# Altium schematic sheet Top Level.SchDoc
size A
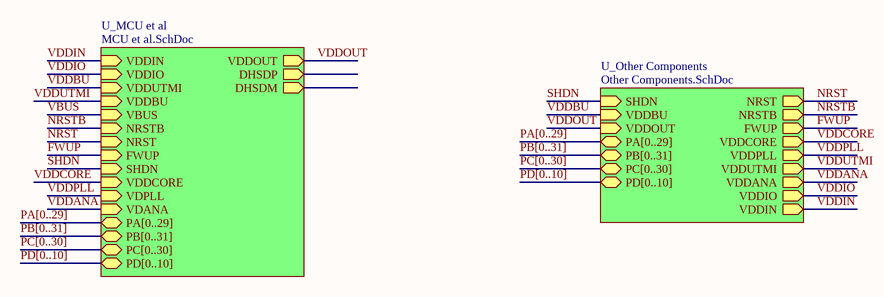
[diagram p0: Top Level.SchDoc]

## Sub-sheets
U_MCU et al = MCU et al.SchDoc: VDDOUT (out), VDDIN (in), VDDIO (in), VDDUTMI (in), VDDBU (in), DHSDP (out), DHSDM (out), VBUS (in), NRSTB (in), NRST (in), FWUP (in), SHDN (in), VDDCORE (in), VDPLL (in), VDANA (in), PA[0..29] (bidir), PB[0..31] (bidir), PC[0..30] (bidir), PD[0..10] (bidir)
U_Other Components = Other Components.SchDoc: SHDN (in), NRST (out), NRSTB (out), VDDBU (in), FWUP (out), VDDOUT (in), VDDCORE (out), VDDPLL (out), VDDUTMI (out), VDDANA (out), VDDIO (out), VDDIN (out), PA[0..29] (bidir), PB[0..31] (bidir), PC[0..30] (bidir), PD[0..10] (bidir)

## Nets
FWUP: sheet U_MCU et al/FWUP, sheet U_Other Components/FWUP
NRST: sheet U_MCU et al/NRST, sheet U_Other Components/NRST
NRSTB: sheet U_MCU et al/NRSTB, sheet U_Other Components/NRSTB
SHDN: sheet U_MCU et al/SHDN, sheet U_Other Components/SHDN
VBUS: sheet U_MCU et al/VBUS
VDDANA: sheet U_MCU et al/VDANA, sheet U_Other Components/VDDANA
VDDBU: sheet U_MCU et al/VDDUTMI, sheet U_Other Components/VDDBU
VDDCORE: sheet U_MCU et al/VDDCORE, sheet U_Other Components/VDDCORE
VDDIN: sheet U_MCU et al/VDDIN, sheet U_Other Components/VDDIN
VDDIO: sheet U_MCU et al/VDDIO, sheet U_Other Components/VDDIO
VDDOUT: sheet U_MCU et al/VDDOUT, sheet U_Other Components/VDDOUT
VDDPLL: sheet U_MCU et al/VDPLL, sheet U_Other Components/VDDPLL
VDDUTMI: sheet U_MCU et al/VDDBU, sheet U_Other Components/VDDUTMI

## Buses and harness runs
bus PA[0..29] = sheet U_MCU et al/PA[0..29]
bus PA[0..29] = sheet U_Other Components/PA[0..29]
bus PB[0..31] = sheet U_MCU et al/PB[0..31]
bus PB[0..31] = sheet U_Other Components/PB[0..31]
bus PC[0..30] = sheet U_MCU et al/PC[0..30]
bus PC[0..30] = sheet U_Other Components/PC[0..30]
bus PD[0..10] = sheet U_MCU et al/PD[0..10]
bus PD[0..10] = sheet U_Other Components/PD[0..10]